# Altium project power-dc.PrjPcb
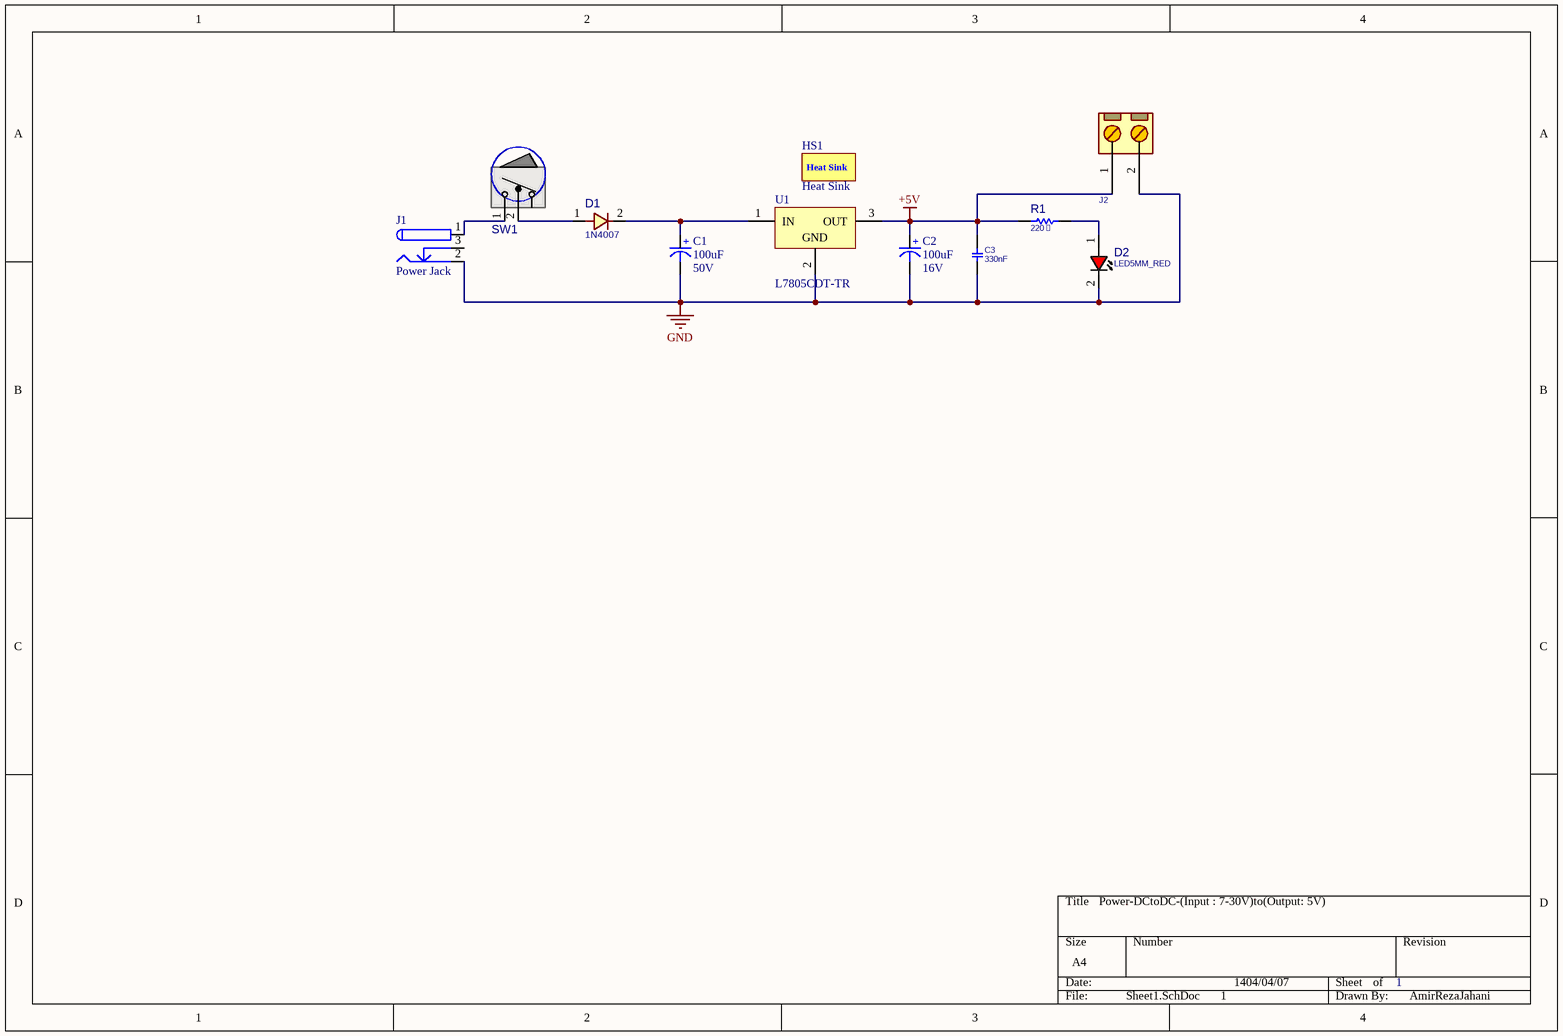
[diagram p0: Sheet1.SchDoc]
1 sheet, 11 parts. Net scope: global (net labels, ports and power ports of the same name join across sheets).
Board file: PCB1.PcbDoc

## Sheet Sheet1.SchDoc
size A4; SheetNumber: 1; SheetTotal: 1

### Parts
C1  Voltage: 50V  [cap 01]  (hidden comment: 100uF)
C2  Voltage: 16V  [cap 01]  (hidden comment: 100uF)
C3  330nF  [C_CERM_D3]
D1  1N4007  [D_AX04_DO41]
D2  LED5MM_RED  [LED5MM_RED]
HS1  Heat Sink  [HeatSink PH51]  (mechanical)
J1  Power Jack  [Power Jack]
J2  CONN_TB2  [MSTB_2]  (value not drawn)
R1  220ꭥ  [R025W_AX04]
SW1  ToggleSwitch  [SWRCK_SPST_S_15X10]  (value not drawn)
U1  L7805CDT-TR  [L7805 Right]

### Nets
+5V: C2.1(+) C3.2 J2.1 R1.2 U1.3(OUT)
GND: C1.2(-) C2.2(-) C3.1 D2.2(CATHODE) J1.2 J2.2 U1.2(GND)
NetC1_1: C1.1(+) D1.2 U1.1(IN)
NetD1_1: D1.1 SW1.2(COM)
NetD2_1: D2.1(ANODE) R1.1
NetJ1_1: J1.1 SW1.1(T1)

Not connected (* = marked no-connect by the designer): J1 3

### Notes on the sheet
- Power-DCtoDC-(Input : 7-30V)to(Output: 5V)
- 1404/04/07
- 1
- AmirRezaJahani

### Library data of the parts
C1 C2 = Cap-Polar: Polar Capacitor; Designer: Saeid Jorablo; Organazation: ControTec; Adding Date: 1387/12/20; Value: 100uF
C3 = CAP_THD_CER: CAP, THD, CER MULTI LAYER,; DESC: CAP, CER MULTI LAYER,; MANF_P#: MANF_PART#; PARAM2: 50V; PRICE: 100= 1$; MANF: MANF; ASSEMBLY: ASSEMBLY; VALUE: 330nF
D1 = DIODE_THD_1N4007: DIODE, GENERAL PURPOSE, 1000V/1A; MANF: Diodes; DESC: DESCRIPTION; PARAM: 1000V, 1.15V; PARAM2: 1.5A; ASSEMBLY: ASSEMBLY; PRICE: PRICE; MANF_P#: 1N4007; VALUE: 1N4007
D2 = LED_THD_5MM_RED: LED, THD, 5MM, RED; DESC: DESCRIPTION; MANF_P#: MANF_PART#; PARAM2: 2.2V; MANF: MANF; ASSEMBLY: ASSEMBLY; PRICE: PRICE; VALUE: LED5MM_RED
HS1 = HeatSink PH51: PH51 Heatsink
J1 = Power Jack: Designer: Saeid Jorablo; Company: Personal; Project Name: Laser; Adding Date: 10/21/2009
J2 = CONN_MSTB_2: CONN, PHOENIX MSTB, 5-G, 5.08mm pitch; PARAM2: 320V; PARAM: 12A; VALUE: CONN_TB2
R1 = RES_THD: RESISTOR, THD; MANF_P#: RK73H1ETTP4701F; MANF: KOA SPEER; PARAM: 0.063W; DESC: DESCRIPTION; DIST#: MOUSER; PARAM2: 1%; ASSEMBLY: ASSEMBLY; PRICE: 100= 0.5$; VALUE: 220ꭥ
SW1 = SWROK_SPST_R_15X10: SWITCH, Rocker, SPST, THD, 15x10.5mm; DESC: DESCRIPTION; MANF: -; MANF_PART#: -; VALUE: ToggleSwitch; ASSEMBLY: ASSEMBLY; PARAM: -; PRICE: -